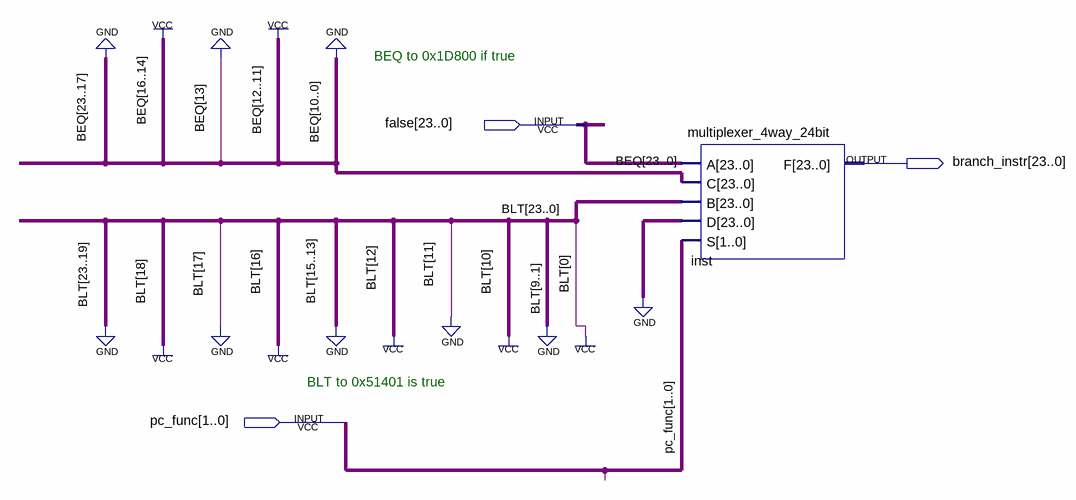
[diagram p0: schematic sheet]
// Quartus schematic branch_block.bdf as structural Verilog: 1 symbols, 3 pins
module branch_block (
  input  [23:0] false,
  input  [1:0] pc_func,
  output [23:0] branch_instr
);

  multiplexer_4way_24bit inst (
    .A(false), .C(24'b000000011101100000000000), .B(24'b000001010001010000000001), .D({24{1'b0}}),
    .S(pc_func), .F(branch_instr));

  // Notes on the sheet:
  //   BEQ to 0x1D800 if true
  //   BLT to 0x51401 is true
endmodule
